# Altium schematic sheet pid.SchDoc
size A3; SheetNumber: 3; SheetTotal: 3
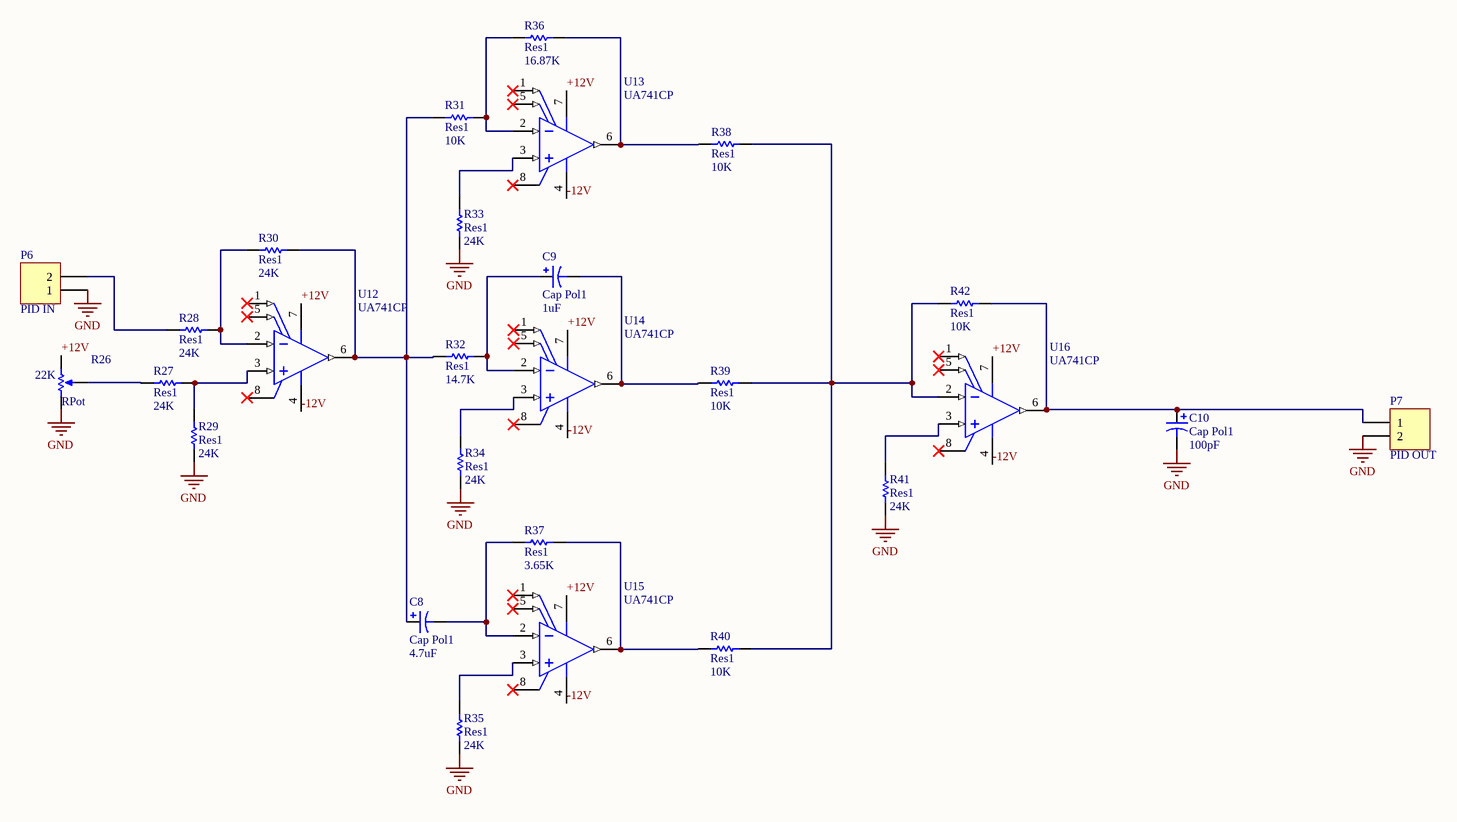
[diagram p0: pid.SchDoc]

## Parts
C8  Cap Pol1  value 4.7uF  [RB7.6-15]
C9  Cap Pol1  value 1uF  [RB7.6-15]
C10  Cap Pol1  value 100pF  [RB7.6-15]
P6  PID IN  [HDR1X2]
P7  PID OUT  [HDR1X2]
R26  RPot  value 22K  [VR5]
R27  Res1  value 24K  [AXIAL-0.3]
R28  Res1  value 24K  [AXIAL-0.3]
R29  Res1  value 24K  [AXIAL-0.3]
R30  Res1  value 24K  [AXIAL-0.3]
R31  Res1  value 10K  [AXIAL-0.3]
R32  Res1  value 14.7K  [AXIAL-0.3]
R33  Res1  value 24K  [AXIAL-0.3]
R34  Res1  value 24K  [AXIAL-0.3]
R35  Res1  value 24K  [AXIAL-0.3]
R36  Res1  value 16.87K  [AXIAL-0.3]
R37  Res1  value 3.65K  [AXIAL-0.3]
R38  Res1  value 10K  [AXIAL-0.3]
R39  Res1  value 10K  [AXIAL-0.3]
R40  Res1  value 10K  [AXIAL-0.3]
R41  Res1  value 24K  [AXIAL-0.3]
R42  Res1  value 10K  [AXIAL-0.3]
U12  UA741CP  [P0008A]
U13  UA741CP  [P0008A]
U14  UA741CP  [P0008A]
U15  UA741CP  [P0008A]
U16  UA741CP  [P0008A]

## Nets
GND: C10.2 P6.1 P7.2 R26.1(TOP) R29.2 R33.2 R34.2 R35.2 R41.2
+12V: R26.2(BOT) U12.7(VCC+) U13.7(VCC+) U14.7(VCC+) U15.7(VCC+) U16.7(VCC+)
-12V: U12.4(VCC-) U13.4(VCC-) U14.4(VCC-) U15.4(VCC-) U16.4(VCC-)
NetC8_1: C8.1 R30.1 R31.2 R32.2 U12.6(OUT)
NetC8_2: C8.2 R37.2 U15.2(IN-)
NetC9_1: C9.1 R32.1 U14.2(IN-)
NetC9_2: C9.2 R39.2 U14.6(OUT)
NetC10_1: C10.1 P7.1 R42.1 U16.6(OUT)
NetP6_2: P6.2 R28.2
NetR26_3: R26.3(TAP) R27.2
NetR27_1: R27.1 R29.1 U12.3(IN+)
NetR28_1: R28.1 R30.2 U12.2(IN-)
NetR31_1: R31.1 R36.2 U13.2(IN-)
NetR33_1: R33.1 U13.3(IN+)
NetR34_1: R34.1 U14.3(IN+)
NetR35_1: R35.1 U15.3(IN+)
NetR36_1: R36.1 R38.2 U13.6(OUT)
NetR37_1: R37.1 R40.2 U15.6(OUT)
NetR38_1: R38.1 R39.1 R40.1 R42.2 U16.2(IN-)
NetR41_1: R41.1 U16.3(IN+)

Not connected (* = marked no-connect by the designer): U12 1(OFFSET_N1)* 5(OFFSET_N2)* 8(NC)*; U13 1(OFFSET_N1)* 5(OFFSET_N2)* 8(NC)*; U14 1(OFFSET_N1)* 5(OFFSET_N2)* 8(NC)*; U15 1(OFFSET_N1)* 5(OFFSET_N2)* 8(NC)*; U16 1(OFFSET_N1)* 5(OFFSET_N2)* 8(NC)*

## Library data of the parts
C8-C10 = Cap Pol1: Polarized Capacitor (Radial); Published: 8-Jun-2000; LatestRevisionDate: 17-Jul-2002; LatestRevisionNote: Re-released for DXP Platform.; PackageReference: RB7.6-15; Publisher: Altium Limited; PackageDescription: Polarized Capacitor (Radial); 2 Leads
P6 P7 = Header 2: Header, 2-Pin; LatestRevisionDate: 17-Jul-2002; LatestRevisionNote: Re-released for DXP Platform.; Publisher: Altium Limited
R26 = RPot: Potentiometer; Sim Note: Enter the Resistance value and the set point into parameter fields.; Set Position: 0.5; Published: 8-Jun-2000; LatestRevisionDate: 17-Jul-2002; LatestRevisionNote: Re-released for DXP Platform.; PackageReference: VR5; Publisher: Altium Limited; PackageDescription: Variable Resistor, Thru-Hole; 3 Leads
R27-R42 = Res1: Resistor; Published: 8-Jun-2000; LatestRevisionDate: 17-Jul-2002; LatestRevisionNote: Re-released for DXP Platform.; PackageReference: AXIAL-0.3; Publisher: Altium Limited; PackageDescription: Axial Device, Thru-Hole; 2 Leads; 0.3 in Pin Spacing
U12-U16 = CMP-0017-00973-2: General-Purpose Operational Amplifier, 7 to 36 V, 0 to 70 degC, 8-pin DIP (P8), Pb-Free (RoHS); Manufacturer: Texas Instruments; Iq per channel(Max)(mA): 2.8; Number of Channels: 1; Total Supply Voltage(Min)(+5V is 5, +/-5V is 10): 7; IIB(Max)(pA): 800000; Slew Rate(Typ)(V/us): 0.5; Total Supply Voltage(Max)(+5V is 5, +/-5V is 10): 36; Vio (25C)(Max)(mV): 6; CMRR(Min)(dB): 70; Sub Family: General Purpose Amplifier, High Supply Voltage Amplifier (>=30V); PackageVersion: 4040082/E, 04/2010; PackageReference: P0008A; ComponentLink1URL: http://www.ti.com/; Mounting Technology: Through Hole; ComponentLink1Description: Manufacturer URL; GBW(Typ)(MHz): 1; ComponentLink2Description: Datasheet; ComponentLink2URL: http://www.ti.com/lit/ds/symlink/ua741.pdf; PartNumber: UA741CP; Code_JEDEC: MS-001; ComponentLink3Description: Package Specification; DatasheetVersion: SLOS094B; ComponentLink3URL: http://www.ti.com/litv/pdf/mpdi001b; PackageDescription: 8-Pin Plastic In-Line, Body 9.59 x 6.35 mm, Pitch 2.54 mm; Eco-Plan: Pb-Free (RoHS)